# Altium schematic sheet main.SchDoc
size A3; Organization: Medical Technologies CZ a.s.; Version1: N/A; Version2: N/A; Version3: N/A; Change1description: N/A; Change2description: N/A; Change3description: N/A; Change1DrawnBy: N/A; Change2DrawnBy: N/A; Change3DrawnBy: N/A; Change1CheckedBy: N/A; Change2CheckedBy: N/A; Change3CheckedBy: N/A; PreviusVersion_Chng1: N/A; PreviusVersion_Chng2: N/A; PreviusVersion_Chng3: N/A; Variant1description: Standard assembly; Variant2description: N/A; Variant3description: N/A; Variant4description: N/A; PrimaryCard1: XXXxxxXXX; PrimaryCard2: N/A; PrimaryCard3: N/A; PrimaryCard4: N/A; DocumentName: Docname
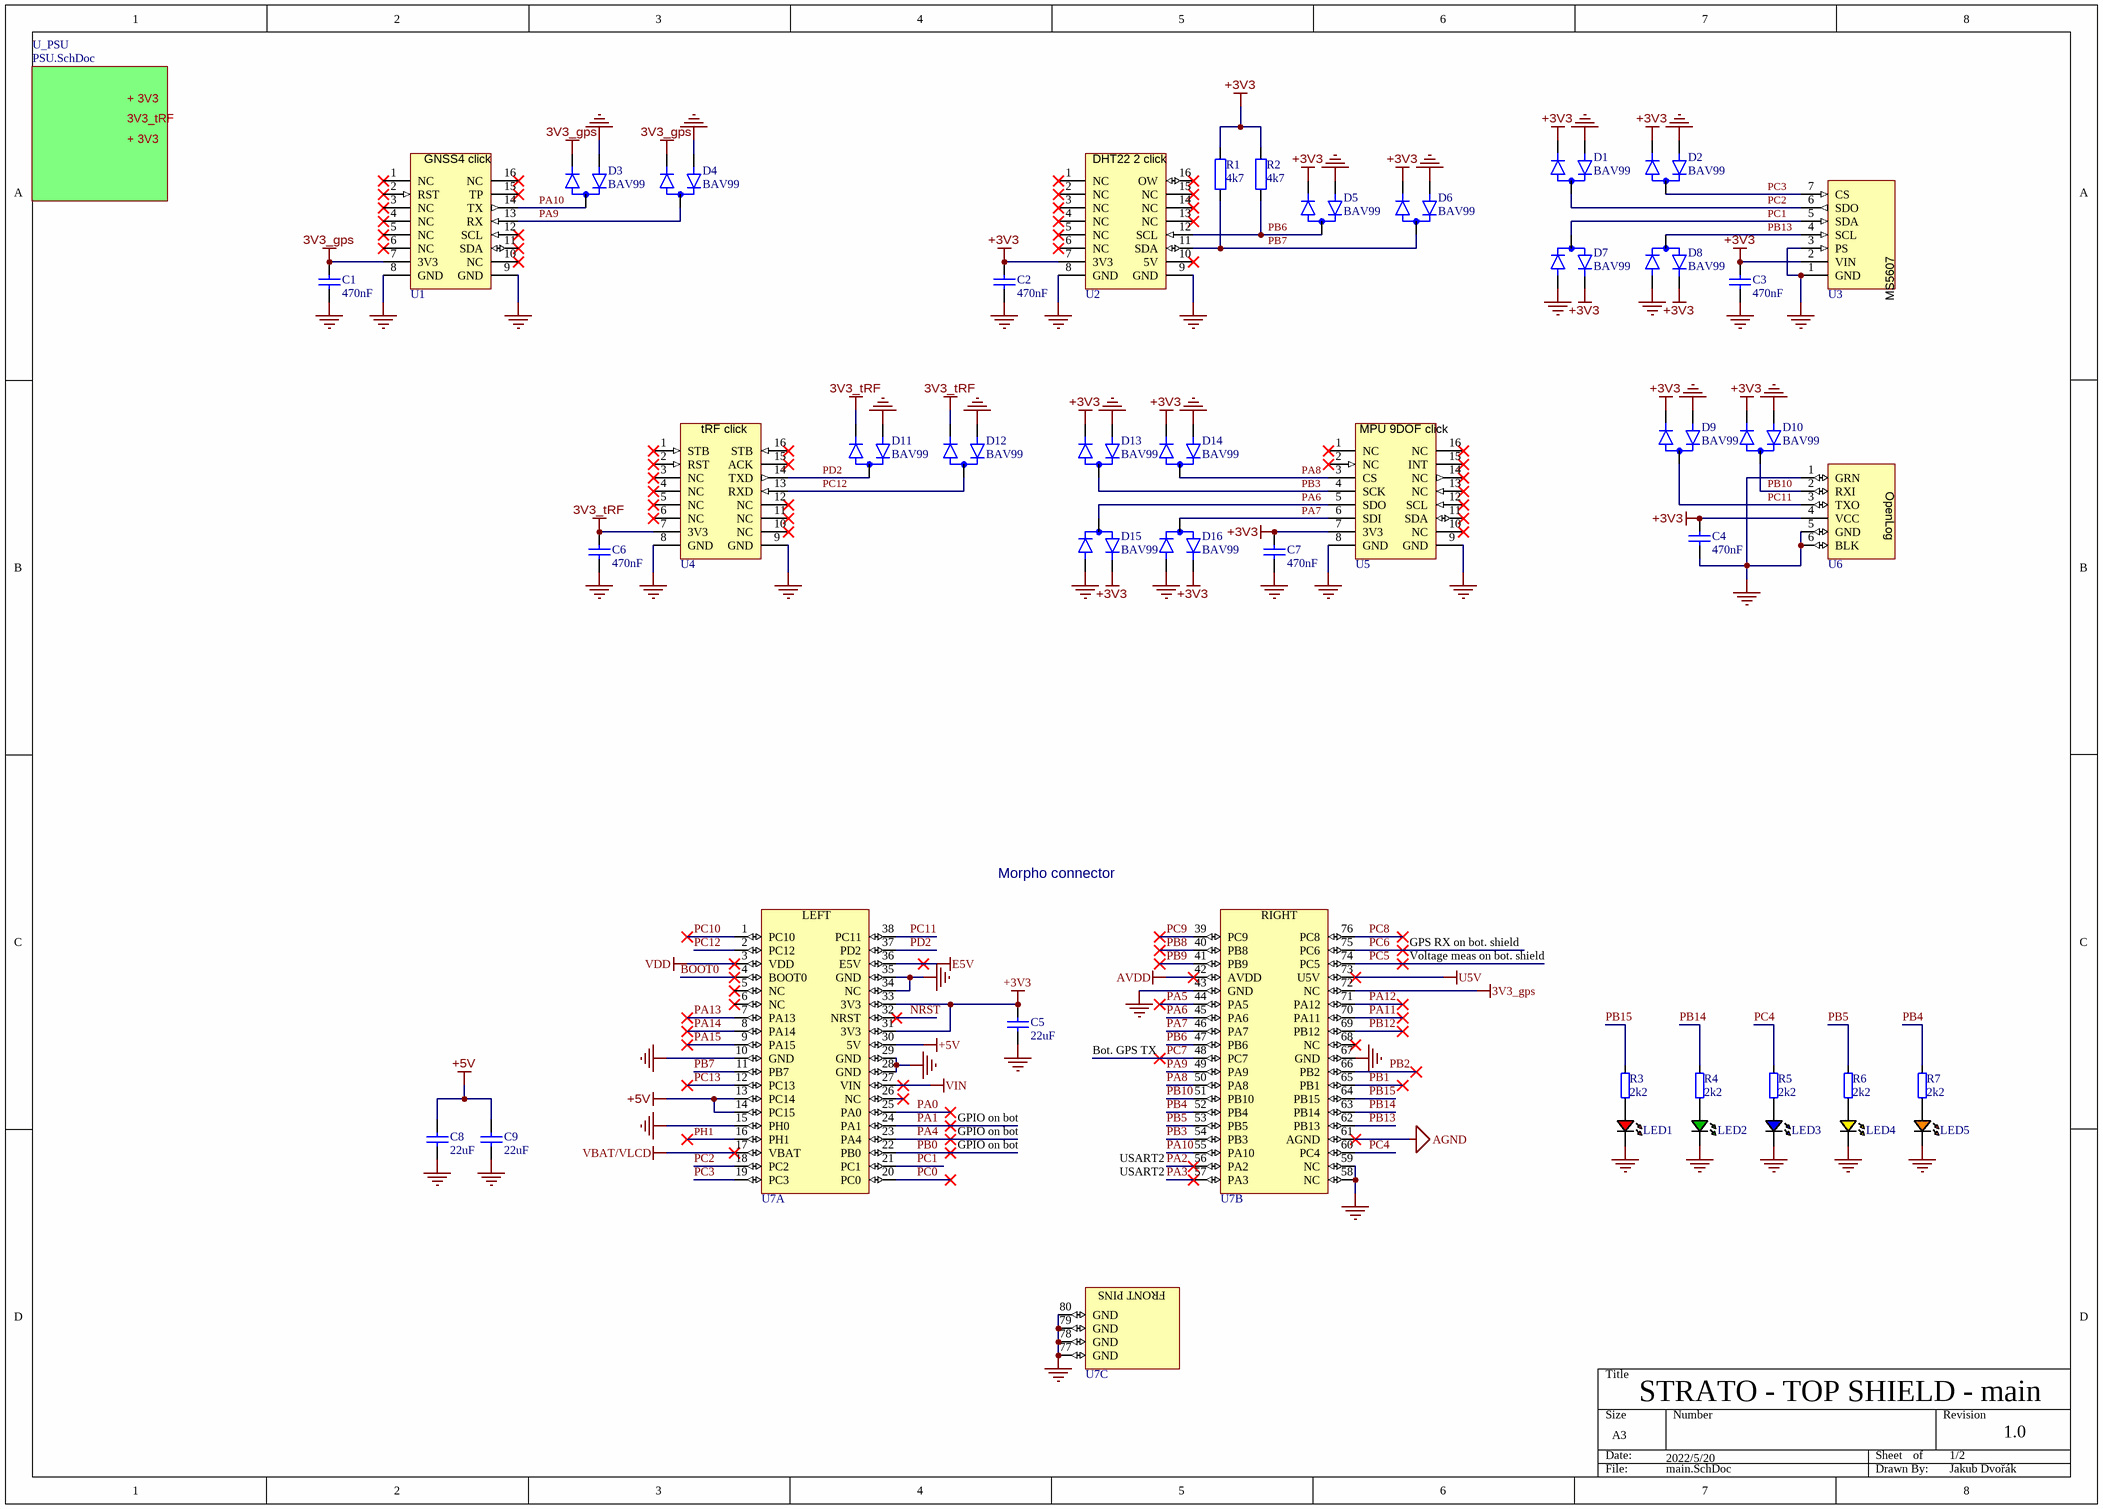
[diagram p0: main.SchDoc]

## Parts
C1  470nF  [WCAP-CSGP_0805_L2W1.25H1.25]
C2  470nF  [WCAP-CSGP_0805_L2W1.25H1.25]
C3  470nF  [WCAP-CSGP_0805_L2W1.25H1.25]
C4  470nF  [WCAP-CSGP_0805_L2W1.25H1.25]
C5  22uF  [WCAP-CSGP_0805_L2W1.25H1.25]
C6  470nF  [WCAP-CSGP_0805_L2W1.25H1.25]
C7  470nF  [WCAP-CSGP_0805_L2W1.25H1.25]
C8  22uF  [WCAP-CSGP_0805_L2W1.25H1.25]
C9  22uF  [WCAP-CSGP_0805_L2W1.25H1.25]
D1  BAV99  [SOT95P230X110-3N(SOT23)]
D2  BAV99  [SOT95P230X110-3N(SOT23)]
D3  BAV99  [SOT95P230X110-3N(SOT23)]
D4  BAV99  [SOT95P230X110-3N(SOT23)]
D5  BAV99  [SOT95P230X110-3N(SOT23)]
D6  BAV99  [SOT95P230X110-3N(SOT23)]
D7  BAV99  [SOT95P230X110-3N(SOT23)]
D8  BAV99  [SOT95P230X110-3N(SOT23)]
D9  BAV99  [SOT95P230X110-3N(SOT23)]
D10  BAV99  [SOT95P230X110-3N(SOT23)]
D11  BAV99  [SOT95P230X110-3N(SOT23)]
D12  BAV99  [SOT95P230X110-3N(SOT23)]
D13  BAV99  [SOT95P230X110-3N(SOT23)]
D14  BAV99  [SOT95P230X110-3N(SOT23)]
D15  BAV99  [SOT95P230X110-3N(SOT23)]
D16  BAV99  [SOT95P230X110-3N(SOT23)]
LED1  red  [0805LEDR]  (value not drawn)
LED2  green  [0805LEDG]  (value not drawn)
LED3  blue  [0805LEDB]  (value not drawn)
LED4  yellow  [0805LEDYell]  (value not drawn)
LED5  orange  [0805LEDOra]  (value not drawn)
R1  value 4k7  [RES_0603]  (hidden comment: Thick film)
R2  value 4k7  [RES_0603]  (hidden comment: Thick film)
R3  value 2k2  [RES_0603]  (hidden comment: Thick film)
R4  value 2k2  [RES_0603]  (hidden comment: Thick film)
R5  value 2k2  [RES_0603]  (hidden comment: Thick film)
R6  value 2k2  [RES_0603]  (hidden comment: Thick film)
R7  value 2k2  [RES_0603]  (hidden comment: Thick film)
U1  GNSS4 cllick  [GNSS4 click]  (value not drawn)
U2  DHT22 2 click  [DHT22 2 click]  (value not drawn)
U3  MS5607  [MS5607]  (value not drawn)
U4  tRF click  [tRF click]  (value not drawn)
U5  MPU 9DOF click  [MPU 9DOF click]  (value not drawn)
U6  OpenLog  [OpenLog]  (value not drawn)
U7  NUCLEO F466 MORPHO LEFT  [Nucleo_bot_pads]  (value not drawn)  (parts A,B,C of 3)

## Sub-sheets
U_PSU = PSU.SchDoc: no entries

## Nets
3V3_gps: C1.2 D3.2(C2) D4.2(C2) U1.7(3V3) U7.72(NC)
3V3_tRF: C6.2 D11.2(C2) D12.2(C2) U4.7(3V3)
+3V3: C2.2 C3.2 C4.2 C5.2 C7.2 D1.2(C2) D2.2(C2) D5.2(C2) D6.2(C2) D7.2(C2) D8.2(C2) D9.2(C2) D10.2(C2) D13.2(C2) D14.2(C2) D15.2(C2) D16.2(C2) R1.2 R2.2 U2.7(3V3) U3.2(VIN) U5.7(3V3) U6.4(VCC) U7.31(3V3) U7.33(3V3)
+5V: C8.2 C9.2 U7.13(PC14) U7.14(PC15) U7.30(5V)
AGND: U7.61(AGND)
AVDD: U7.42(AVDD)
E5V: U7.36(E5V)
GND: C1.1 C2.1 C3.1 C4.1 C5.1 C6.1 C7.1 C8.1 C9.1 D1.1(A1) D2.1(A1) D3.1(A1) D4.1(A1) D5.1(A1) D6.1(A1) D7.1(A1) D8.1(A1) D9.1(A1) D10.1(A1) D11.1(A1) D12.1(A1) D13.1(A1) D14.1(A1) D15.1(A1) D16.1(A1) LED1.K LED2.K LED3.K LED4.K LED5.K U1.8(GND) U1.9(GND) U2.8(GND) U2.9(GND) U3.1(GND) U3.3(PS) U4.8(GND) U4.9(GND) U5.8(GND) U5.9(GND) U6.1(GRN) U6.5(GND) U6.6(BLK) U7.10(GND) U7.15(PH0) U7.28(GND) U7.29(GND) U7.34(NC) U7.35(GND) U7.43(GND) U7.58(NC) U7.59(NC) U7.67(GND) U7.77(GND) U7.78(GND) U7.79(GND) U7.80(GND)
U5V: U7.73(U5V)
VBAT/VLCD: U7.17(VBAT)
VDD: U7.3(VDD)
VIN: U7.27(VIN)
BOOT0: U7.4(BOOT0)
NRST: U7.32(NRST)
PA0: U7.25(PA0)
PA1: U7.24(PA1)
PA2: U7.56(PA2)
PA3: U7.57(PA3)
PA4: U7.23(PA4)
PA5: U7.44(PA5)
PA6: D15.3(C1A2) U5.5(SDO) U7.45(PA6)
PA7: D16.3(C1A2) U5.6(SDI) U7.46(PA7)
PA8: D14.3(C1A2) U5.3(CS) U7.50(PA8)
PA9: D4.3(C1A2) U1.13(RX) U7.49(PA9)
PA10: D3.3(C1A2) U1.14(TX) U7.55(PA10)
PA11: U7.70(PA11)
PA12: U7.71(PA12)
PA13: U7.7(PA13)
PA14: U7.8(PA14)
PA15: U7.9(PA15)
PB0: U7.22(PB0)
PB1: U7.65(PB1)
PB2: U7.66(PB2)
PB3: D13.3(C1A2) U5.4(SCK) U7.54(PB3)
PB4: R7.2 U7.52(PB4)
PB5: R6.2 U7.53(PB5)
PB6: D5.3(C1A2) R2.1 U2.12(SCL) U7.47(PB6)
PB7: D6.3(C1A2) R1.1 U2.11(SDA) U7.11(PB7)
PB8: U7.40(PB8)
PB9: U7.41(PB9)
PB10: D10.3(C1A2) U6.2(RXI) U7.51(PB10)
PB12: U7.69(PB12)
PB13: D8.3(C1A2) U3.4(SCL) U7.62(PB13)
PB14: R4.2 U7.63(PB14)
PB15: R3.2 U7.64(PB15)
PC0: U7.20(PC0)
PC1: D7.3(C1A2) U3.5(SDA) U7.21(PC1)
PC2: D1.3(C1A2) U3.6(SDO) U7.18(PC2)
PC3: D2.3(C1A2) U3.7(CS) U7.19(PC3)
PC4: R5.2 U7.60(PC4)
PC5: U7.74(PC5)
PC6: U7.75(PC6)
PC7: U7.48(PC7)
PC8: U7.76(PC8)
PC9: U7.39(PC9)
PC10: U7.1(PC10)
PC11: D9.3(C1A2) U6.3(TXO) U7.38(PC11)
PC12: D12.3(C1A2) U4.13(RXD) U7.2(PC12)
PC13: U7.12(PC13)
PD2: D11.3(C1A2) U4.14(TXD) U7.37(PD2)
PH1: U7.16(PH1)
NetLED1_A: LED1.A R3.1
NetLED2_A: LED2.A R4.1
NetLED3_A: LED3.A R5.1
NetLED4_A: LED4.A R6.1
NetLED5_A: LED5.A R7.1

Not connected (* = marked no-connect by the designer): U1 1(NC)* 2(RST)* 3(NC)* 4(NC)* 5(NC)* 6(NC)* 10(NC)* 11(SDA)* 12(SCL)* 15(TP)* 16(NC)*; U2 1(NC)* 2(NC)* 3(NC)* 4(NC)* 5(NC)* 6(NC)* 10(5V)* 13(NC)* 14(NC)* 15(NC)* 16(OW)*; U4 1(STB)* 2(RST)* 3(NC)* 4(NC)* 5(NC)* 6(NC)* 10(NC)* 11(NC)* 12(NC)* 15(ACK)* 16(STB)*; U5 1(NC)* 2(NC)* 10(NC)* 11(SDA)* 12(SCL)* 13(NC)* 14(NC)* 15(INT)* 16(NC)*; U7 5(NC)* 6(NC)* 26(NC)* 68(NC)*

## Notes on the sheet
- + 3V3
- 3V3_tRF
- Morpho connector
- GPS RX on bot. shield
- Voltage meas on bot. shield
- Bot. GPS TX
- GPIO on bot
- USART2
- STRATO - TOP SHIELD - main
- 2022/5/20
- 1/2
- 1.0
- Jakub Dvořák
- Číslo výkresu /drawing number/:
- DPS projekt/PCB project/:
- Kreslil /drawn by/ :
- Kontroloval /checked by/:
- Schvalil /approved by/:
- Podpis /signature/:
- Datum /date/:
- List /sheet/:
- /
- (in symbol GNSS4 cllick) GNSS4 click
- (in symbol NUCLEO F466 MORPHO LEFT, part A) LEFT
- (in symbol NUCLEO F466 MORPHO LEFT, part B) RIGHT
- (in symbol NUCLEO F466 MORPHO LEFT, part C) FRONT PINS

## Library data of the parts
C1-C4 C6 C7 = 885012207102: WCAP-CSGP Multilayer Ceramic Chip Capacitor, General Purpose, size 0805, X7R, 470nF, 50V; Manufacturer: Wurth Elektronik; Capacitance Tolerance: +/-10%; Dissipation Factor: 3%; Isolation Resistance: 1.1GOhm; Technical Reference: X7R0805474K050DFCT10000; Capacitance: 470nF; Ceramic Type: X7R; ComponentLink1Description: Manufacturer Link; ComponentLink1URL: http://www.we-online.de; ComponentLink2Description: Datasheet; ComponentLink2URL: https://www.we-online.com/catalog/datasheet/885012207102.pdf; Height: 1.25mm; Length: 2mm; Manufacturer Part Number: 885012207102; Mounting Technology: SMT; Operating Temperature max.: 125C; Operating Temperature min.: -55C; Packaging: Tape and Reel; Rated Voltage: 50V; Size: 0805; Width: 1.25mm
C5 C8 C9 = 885012107011: WCAP-CSGP Multilayer Ceramic Chip Capacitor, General Purpose, size 0805, X5R, 22uF, 10V; Manufacturer: Wurth Elektronik; Capacitance Tolerance: +/-20%; Dissipation Factor: 10%; Isolation Resistance: 0.005GOhm; Technical Reference: X5R0805226M010DFCT10000; Capacitance: 22uF; Ceramic Type: X5R; ComponentLink1Description: Manufacturer Link; ComponentLink1URL: http://www.we-online.de; ComponentLink2Description: Datasheet; ComponentLink2URL: https://www.we-online.com/catalog/datasheet/885012107011.pdf; Height: 1.25mm; Length: 2mm; Manufacturer Part Number: 885012107011; Mounting Technology: SMT; Operating Temperature max.: 85C; Operating Temperature min.: -55C; Packaging: Tape and Reel; Rated Voltage: 10V; Size: 0805; Width: 1.25mm
LED1 = LEDR_0805
LED2 = LEDG_0805
LED3 = LEDB_0805
LED4 = LEDYell_0805
LED5 = LEDOra_0805
R1 R2 = RES_4k7_5%_0603: 4700.00; Tolerance [%]: ±5; Power Rating [W]: 0.1; Case [EIA]: 0603; Case [Metric]: 1608; Value [Ω]: 4700.00
R3-R7 = RES_2k2_5%_0603: 2200.00; Tolerance [%]: ±5; Power Rating [W]: 0.1; Case [EIA]: 0603; Case [Metric]: 1608; Value [Ω]: 2200.00
D1-D16 = BAV99: ComponentLink1Description: New link; ComponentLink1URL: C:\Users\Public\Documents\Altium\DSH\EDD+BAV99XX0_OnsemiEN100.PDF